# EAGLE design E32_Roco_43917_Lichtplatine_J1_019_02_04 (EAGLE 5.10)
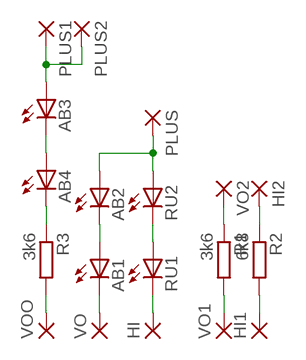
[diagram p0: schematic, sheet 1]

## Parts
AB1  LEDCHIP-LED0603  [CHIP-LED0603]
AB2  LEDCHIP-LED0603  [CHIP-LED0603]
AB3  LEDCHIP-LED0603  [CHIP-LED0603]
AB4  LEDCHIP-LED0603  [CHIP-LED0603]
HI  SMD-LONG1,27-1,9  [SMD1,27-1,9]
HI1  SMD-LONG1,27-1,9  [SMD1,27-1,9]
HI2  SMD-LONG1,27-1,9  [SMD1,27-1,9]
PLUS  SMD-LONG1,27-1,9  [SMD1,27-1,9]
PLUS1  SMD-LONG1,27-1,9  [SMD1,27-1,9]
PLUS2  SMD-LONG1,27-1,9  [SMD1,27-1,9]
R1  3k6  R-EU_R0603  [R0603]
R2  6k8  R-EU_R0603  [R0603]
R3  3k6  R-EU_R0603  [R0603]
RU1  LEDCHIP-LED0603  [CHIP-LED0603]
RU2  LEDCHIP-LED0603  [CHIP-LED0603]
VO  SMD-LONG1,27-1,9  [SMD1,27-1,9]
VO1  SMD-LONG1,27-1,9  [SMD1,27-1,9]
VO2  SMD-LONG1,27-1,9  [SMD1,27-1,9]
VOO  SMD-LONG1,27-1,9  [SMD1,27-1,9]

## Nets
N$1: AB3.C AB4.A
N$2: AB2.A PLUS.1(P) RU2.A
N$3: R1.1 VO2.1(P)
N$4: AB1.A AB2.C
N$5: R1.2 VO1.1(P)
N$6: RU1.A RU2.C
N$7: HI2.1(P) R2.1
N$8: R3.2 VOO.1(P)
N$9: AB3.A PLUS1.1(P) PLUS2.1(P)
N$10: HI1.1(P) R2.2
N$12: AB4.C R3.1
N$13: HI.1(P) RU1.C
N$14: AB1.C VO.1(P)

## Library data of the parts
AB1-AB4 RU1 RU2 = led:LED: LED OSRAM: - CHIPLED LG R971, LG N971, LY N971, LG Q971, LY Q971, LO R971, LY R971 LH N974, LH R974 LS Q976, LO Q976, LY Q976 LO Q996 - Hyper CHIPLED LW Q18S LB Q993, LB Q99A, LB R99A - SideLED LS A670, LO A670, LY A670, LG A670, LP A670 LB A673, LV A673, LT A673, LW A673 LH A674 LY A675 LS A676, LA A676, LO A676, LY A676, LW A676 LS A679, LY A679, LG A679 - Hyper Micro SIDELED® LS Y876, LA Y876, LO Y876, LY Y876 LT Y87S - SmartLED LW L88C, LW L88S LB L89C, LB L89S, LG L890 LS L89K, LO L89K, LY L89K LS L896, LA L896, LO L896, LY L896 - TOPLED LS T670, LO T670, LY T670, LG T670, LP T670 LSG T670, LSP T670, LSY T670, LOP T670, LYG T670 LG T671, LOG T671, LSG T671 LB T673, LV T673, LT T673, LW T673 LH T674 LS T676, LA T676, LO T676, LY T676, LB T676, LH T676, LSB T676, LW T676 LB T67C, LV T67C, LT T67C, LS T67K, LO T67K, LY T67K, LW E67C LS E67B, LA E67B, LO E67B, LY E67B, LB E67C, LV E67C, LT E67C LW T67C LS T679, LY T679, LG T679 LS T770, LO T770, LY T770, LG T770, LP T770 LB T773, LV T773, LT T773, LW T773 LH T774 LS E675, LA E675, LY E675, LS T675 LS T776, LA T776, LO T776, LY T776, LB T776 LHGB T686 LT T68C, LB T68C - Hyper Mini TOPLED® LB M676 - Mini TOPLED Santana® LG M470 LS M47K, LO M47K, LY M47K Source: http://www.osram.convergy.de LUXEON: - LUMILED® LXK2-PW12-R00, LXK2-PW12-S00, LXK2-PW14-U00, LXK2-PW14-V00 LXK2-PM12-R00, LXK2-PM12-S00, LXK2-PM14-U00 LXK2-PE12-Q00, LXK2-PE12-R00, LXK2-PE12-S00, LXK2-PE14-T00, LXK2-PE14-U00 LXK2-PB12-K00, LXK2-PB12-L00, LXK2-PB12-M00, LXK2-PB14-N00, LXK2-PB14-P00, LXK2-PB14-Q00 LXK2-PR12-L00, LXK2-PR12-M00, LXK2-PR14-Q00, LXK2-PR14-R00 LXK2-PD12-Q00, LXK2-PD12-R00, LXK2-PD12-S00 LXK2-PH12-R00, LXK2-PH12-S00 LXK2-PL12-P00, LXK2-PL12-Q00, LXK2-PL12-R00 Source: www.luxeon.com KINGBRIGHT: KA-3528ASYC Source: www.kingbright.com
HI HI1 HI2 PLUS PLUS1 PLUS2 VO VO1 VO2 VOO = wirepad:SMD-LONG
R1-R3 = rcl:R-EU_: RESISTOR, European symbol

## Board
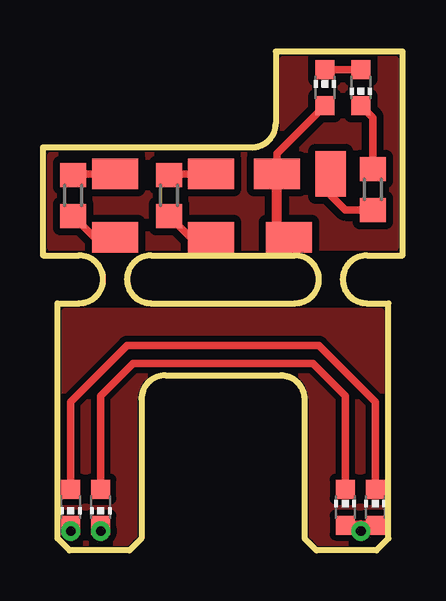
[diagram p1: board, top side]
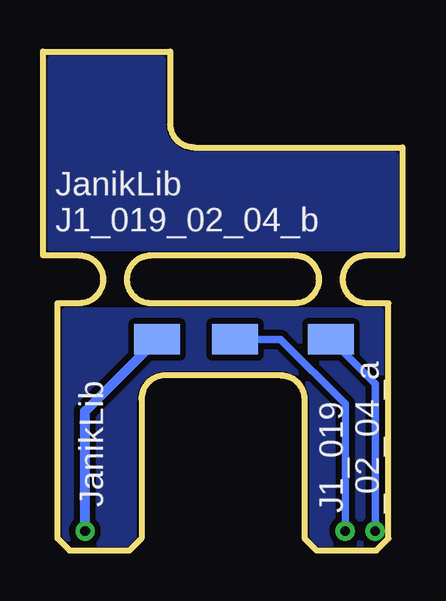
[diagram p2: board, bottom side, seen from below]

No outline drawn. Coordinates in mm, seen from the top.
Copper layers (1*16): Top 0.035mm / dielectric 1.5mm / Bottom 0.035mm
Design rules "default *": minimum track width 7mil, minimum drill 0.4mm, track to track 8mil, track to pad 8mil, pad to pad 8mil, via to via 8mil, smd to smd 8mil, copper to edge 40mil, drill to drill 8mil, minimum pad ring 10mil, minimum via ring 8mil, stop-mask expansion 4mil, vias tented up to drill 0mil, thermal gap 10mil
Milling: 35 lines

### Footprints (pad centres in the part's own frame; a part is rotated, then mirrored left to right if it is on the bottom)
CHIP-LED0603 = smd 0.8 x 0.8: A 0,-0.75; C 0,0.75
SMD1,27-1,9 = smd 1.27 x 1.905: 1 0,0
R0603 = smd 1 x 1.1: 1 -0.85,0; 2 0.85,0

### Placement (x,y rotation side)
AB1  1.15,-9.5 180 top
AB2  13.85,-9.5 0 top
AB3  11.75,8 0 top
AB4  13.25,8 180 top
HI  7,-2.5 90 bottom
HI1  7,4.4 90 top
HI2  7,1.75 90 top
PLUS  10.25,-2.5 270 bottom
PLUS1  9.75,4.4 90 top
PLUS2  10.25,1.75 90 top
R1  1.25,3.5 90 top
R2  5.25,3.5 90 top
R3  13.75,3.75 270 top
RU1  2.4,-9.5 180 top
RU2  12.6,-9.5 0 top
VO  3,-2.5 270 bottom
VO1  3,4.4 90 top
VO2  3,1.75 90 top
VOO  12,4.4 0 top

### Tracks (layer width: path | path; a pad name or v marks a point on that pad's centre or on a via)
N$1
  Top 0.305: AB3.C AB4.A
N$2  (via drill 0.4)
  Top 0.406: RU2.A 13.25,-10.25 | 13.25,-10.25 AB2.A | 13.25,-10.25 v13.25,-10.5
  Bottom 0.406: v13.25,-10.5 13.25,-5.5 PLUS.1
N$3
  Top 0.305: VO2.1 2.15,1.75 R1.1
N$4
  Top 0.305: AB1.A 1.15,-5.1 3.5,-2.75 11.5,-2.75 13.85,-5.1 AB2.C
N$5
  Top 0.305: VO1.1 1.3,4.4 R1.2
N$6
  Top 0.305: RU1.A 2.4,-4.85 3.75,-3.5 11.25,-3.5 12.6,-4.85 RU2.C
N$7
  Top 0.305: HI2.1 6.15,1.75 R2.1
N$8
  Top 0.305: R3.2 12.6,2.9 12,3.5 VOO.1
N$9
  Top 0.305: PLUS1.1 9.75,5.25 AB3.A
  Top 0.406: PLUS1.1 9.75,2.25 PLUS2.1
N$10
  Top 0.305: HI1.1 5.3,4.4 R2.2
N$11
  pour Top (isolate 0.305): 0.3,5.2 8.7,5.2 arc90 10,6.5 10,9.2 14.7,9.2 14.7,1.3 0.3,1.3
  pour Bottom (isolate 0.305): 0.3,5.2 8.7,5.2 arc90 10,6.5 10,9.2 14.7,9.2 14.7,1.3 0.3,1.3
N$12
  Top 0.305: R3.1 13.75,6.75 AB4.C
N$13  (via drill 0.4)
  Top 0.305: v2.4,-10.5 RU1.C
  Bottom 0.305: v2.4,-10.5 2.4,-5.2 5.1,-2.5 HI.1
N$14  (via drill 0.4)
  Top 0.305: v1.15,-10.5 AB1.C
  Bottom 0.305: v1.15,-10.5 1.15,-4.35 VO.1
N$15
  pour Top (isolate 0.254): 0.9,-1.3 14.1,-1.3 14.1,-10.7 13.8,-11 11.5,-11 11.2,-10.7 11.2,-5 arc90 9.9,-3.7 5.1,-3.7 arc90 3.8,-5 3.8,-10.7 3.5,-11 1.2,-11 0.9,-10.7
  pour Bottom (isolate 0.254): 0.9,-1.3 14.1,-1.3 14.1,-10.7 13.8,-11 11.5,-11 11.2,-10.7 11.2,-5 arc90 9.9,-3.7 5.1,-3.7 arc90 3.8,-5 3.8,-10.7 3.5,-11 1.2,-11 0.9,-10.7

### Text on the board
bNames: JanikLib | J1_019_02_04_b | _02_04_a | J1_019 | JanikLib
tStop: Wo | design by Janik Merz
bStop: W | R | +
Document: 1,0mm optimal